# Altium schematic sheet RS_485_V.SchDoc
size C; SheetNumber: 2; SheetTotal: 3
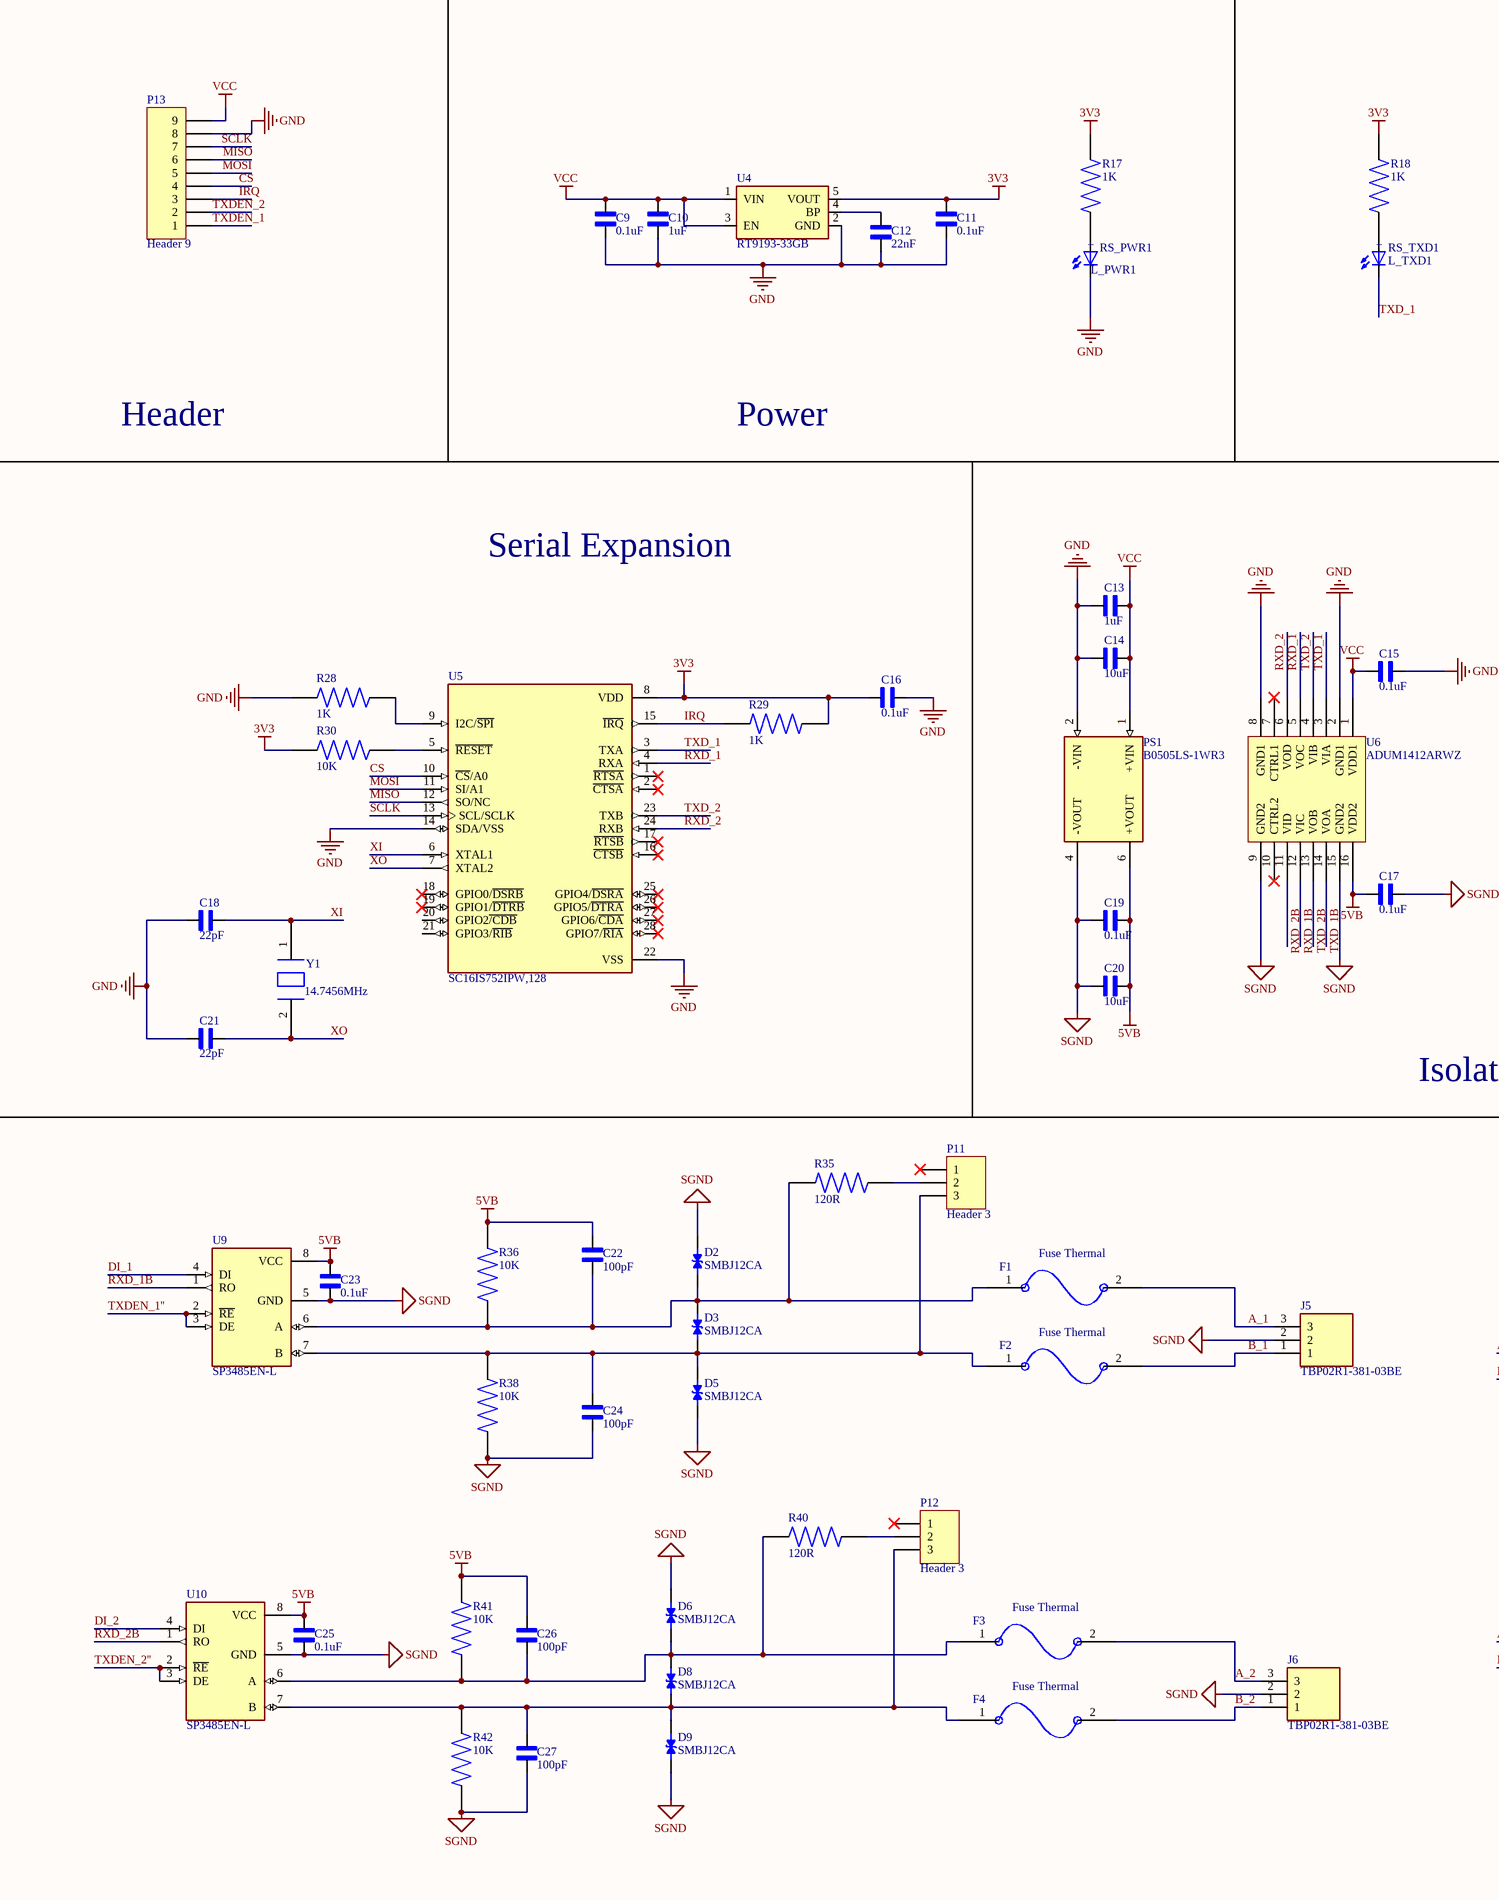
[diagram p0: RS_485_V.SchDoc, left]
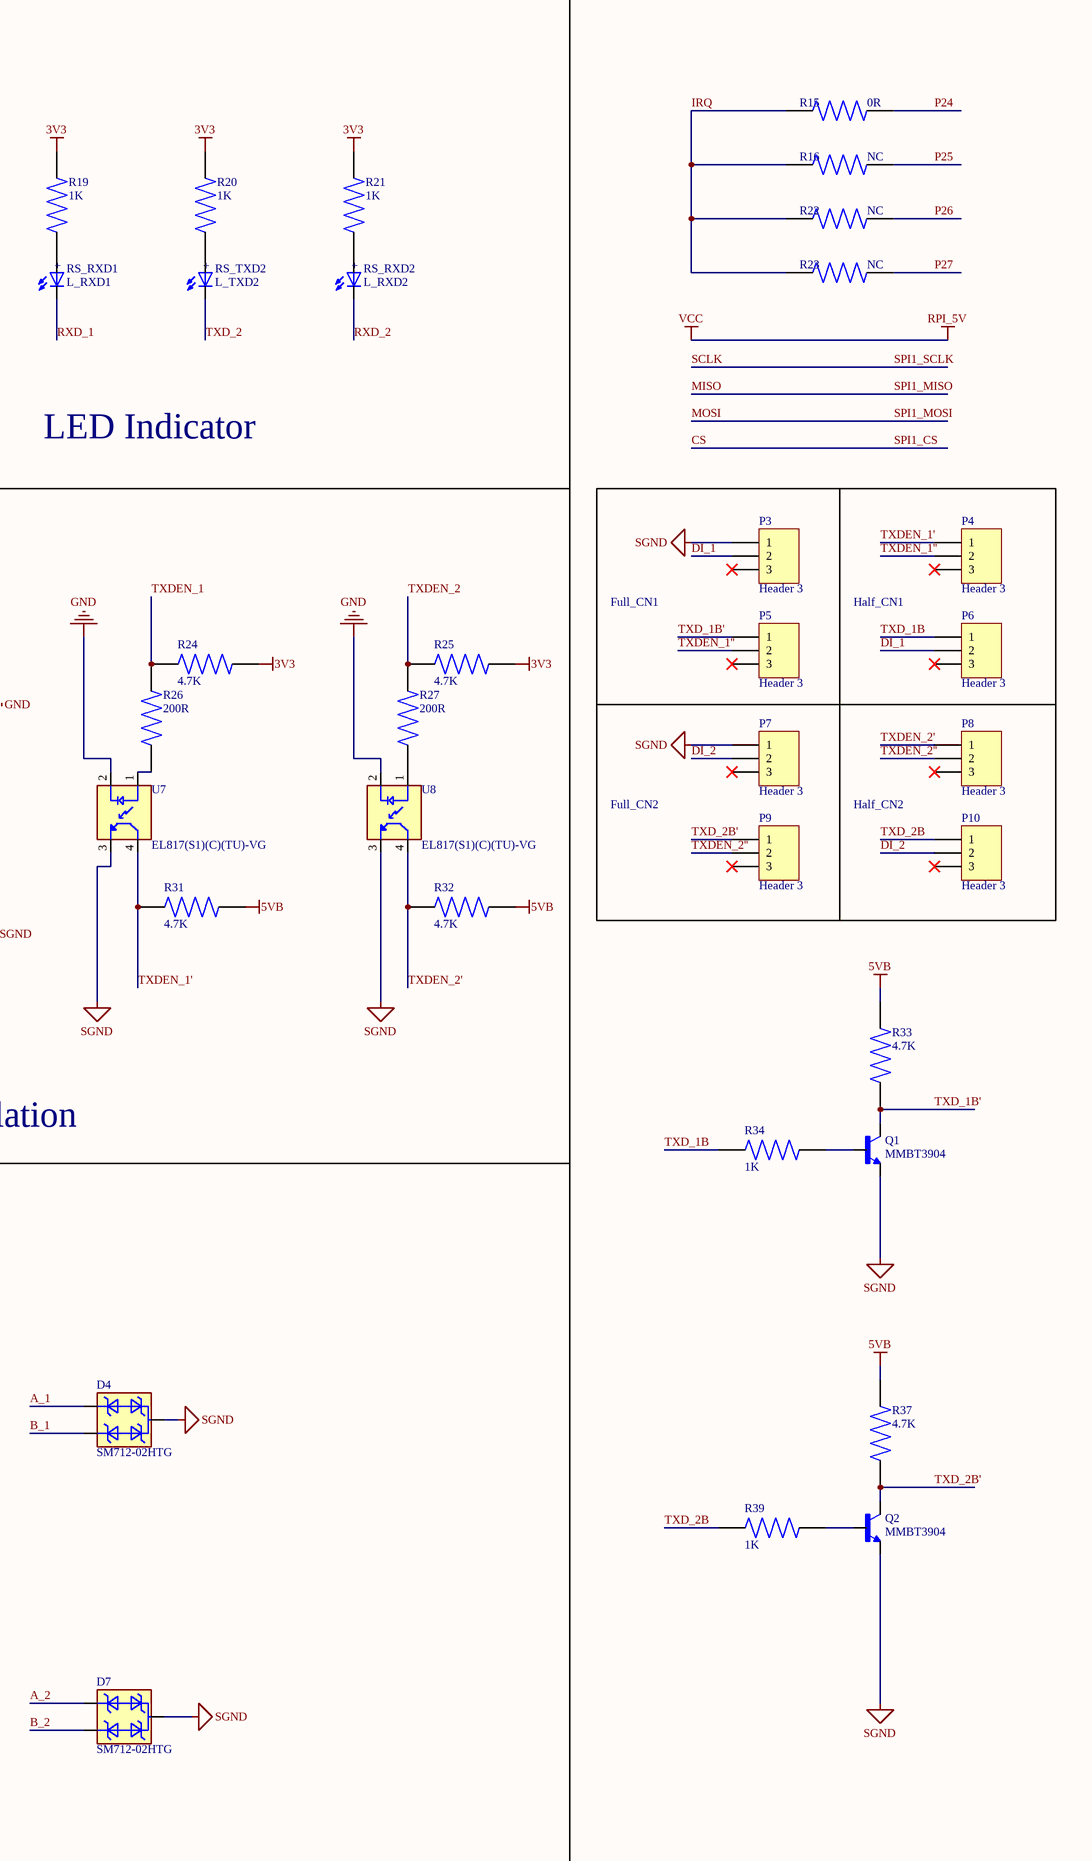
[diagram p1: RS_485_V.SchDoc, right]

## Parts
C9  0.1uF  [CAPC1608X94N]
C10  1uF  [CAPC1608X94N]
C11  0.1uF  [CAPC1608X94N]
C12  22nF  [CAPC1608X94N]
C13  1uF  [CAPC1608X94N]
C14  10uF  [CAPC1608X94N]
C15  0.1uF  [CAPC1608X94N]
C16  0.1uF  [CAPC1608X94N]
C17  0.1uF  [CAPC1608X94N]
C18  22pF  [CAPC1608X94N]
C19  0.1uF  [CAPC1608X94N]
C20  10uF  [CAPC1608X94N]
C21  22pF  [CAPC1608X94N]
C22  100pF  [CAPC1608X94N]
C23  0.1uF  [CAPC1608X94N]
C24  100pF  [CAPC1608X94N]
C25  0.1uF  [CAPC1608X94N]
C26  100pF  [CAPC1608X94N]
C27  100pF  [CAPC1608X94N]
D2  SMBJ12CA  [DIOM4336X265N]
D3  SMBJ12CA  [DIOM4336X265N]
D4  SM712-02HTG  [SOT23]
D5  SMBJ12CA  [DIOM4336X265N]
D6  SMBJ12CA  [DIOM4336X265N]
D7  SM712-02HTG  [SOT23]
D8  SMBJ12CA  [DIOM4336X265N]
D9  SMBJ12CA  [DIOM4336X265N]
F1  Fuse Thermal  [Fuse_thermal]
F2  Fuse Thermal  [Fuse_thermal]
F3  Fuse Thermal  [Fuse_thermal]
F4  Fuse Thermal  [Fuse_thermal]
J5  TBP02R1-381-03BE  [CUI_TBP02R1-381-03BE]
J6  TBP02R1-381-03BE  [CUI_TBP02R1-381-03BE]
P3  Header 3  [HDR1X3]
P4  Header 3  [HDR1X3]
P5  Header 3  [HDR1X3]
P6  Header 3  [HDR1X3]
P7  Header 3  [HDR1X3]
P8  Header 3  [HDR1X3]
P9  Header 3  [HDR1X3]
P10  Header 3  [HDR1X3]
P11  Header 3  [HDR1X3]
P12  Header 3  [HDR1X3]
P13  Header 9  [HDR1X9]
PS1  B0505LS-1WR3  [CONV_RFB-0505S]
Q1  MMBT3904  [TRANS_MMBT3904]
Q2  MMBT3904  [TRANS_MMBT3904]
R15  0R  [RES_ERJU03J474V]
R16  NC  [RES_ERJU03J474V]
R17  1K  [RES_ERJU03J474V]
R18  1K  [RES_ERJU03J474V]
R19  1K  [RES_ERJU03J474V]
R20  1K  [RES_ERJU03J474V]
R21  1K  [RES_ERJU03J474V]
R22  NC  [RES_ERJU03J474V]
R23  NC  [RES_ERJU03J474V]
R24  4.7K  [RES_ERJU03J474V]
R25  4.7K  [RES_ERJU03J474V]
R26  200R  [RES_ERJU03J474V]
R27  200R  [RES_ERJU03J474V]
R28  1K  [RES_ERJU03J474V]
R29  1K  [RES_ERJU03J474V]
R30  10K  [RES_ERJU03J474V]
R31  4.7K  [RES_ERJU03J474V]
R32  4.7K  [RES_ERJU03J474V]
R33  4.7K  [RES_ERJU03J474V]
R34  1K  [RES_ERJU03J474V]
R35  120R  [RES_ERJU03J474V]
R36  10K  [RES_ERJU03J474V]
R37  4.7K  [RES_ERJU03J474V]
R38  10K  [RES_ERJU03J474V]
R39  1K  [RES_ERJU03J474V]
R40  120R  [RES_ERJU03J474V]
R41  10K  [RES_ERJU03J474V]
R42  10K  [RES_ERJU03J474V]
RS_PWR1  L_PWR1  [WL-SMCW_1206]
RS_RXD1  L_RXD1  [WL-SMCW_1206]
RS_RXD2  L_RXD2  [WL-SMCW_1206]
RS_TXD1  L_TXD1  [WL-SMCW_1206]
RS_TXD2  L_TXD2  [WL-SMCW_1206]
U4  RT9193-33GB  [SOT23-5_TEXAS_INSTRUMETNS]
U5  SC16IS752IPW,128  [SOP65P640X110-28N]
U6  ADUM1412ARWZ  [SOIC127P1032X265-16N]
U7  EL817(S1)(C)(TU)-VG  [SOIC254P1030X390-4N_EL817(S1)(C)(TU)-VG]
U8  EL817(S1)(C)(TU)-VG  [SOIC254P1030X390-4N_EL817(S1)(C)(TU)-VG]
U9  SP3485EN-L  [SOIC127P599X175-8N]
U10  SP3485EN-L  [SOIC127P599X175-8N]
Y1  14.7456MHz  [CRY_HC_49_S]

## Nets
3V3: C11.2 C16.1 R17.2 R18.2 R19.2 R20.2 R21.2 R24.1 R25.1 R29.2 R30.1 U4.5(VOUT) U5.8(VDD)
5VB: C17.1 C19.2 C20.2 C22.1 C23.1 C25.1 C26.1 PS1.6(+VOUT) R31.1 R32.1 R33.2 R36.1 R37.2 R41.1 U6.16(VDD2) U9.8(VCC) U10.8(VCC)
GND: C9.1 C10.1 C11.1 C12.1 C13.1 C14.1 C15.2 C16.2 C18.1 C21.1 P13.8 PS1.2(-VIN) R28.1 RS_PWR1.1(NEG) U4.2(GND) U5.14(SDA/VSS) U5.22(VSS) U6.2(GND1) U6.8(GND1) U7.2(C) U8.2(C)
RPI_5V: C9.2 C10.2 C13.2 C14.2 C15.1 P13.9 PS1.1(+VIN) U4.1(VIN) U4.3(EN) U6.1(VDD1)  [also labelled VCC]
SGND: C17.2 C19.1 C20.1 C23.2 C24.2 C25.2 C27.2 D2.2 D4.3 D5.2 D6.2 D7.3 D9.2 J5.2 J6.2 P3.1 P7.1 PS1.4(-VOUT) Q1.2(E) Q2.2(E) R38.2 R42.2 U6.9(GND2) U6.15(GND2) U7.3(ET) U8.3(ET) U9.5(GND) U10.5(GND)
A_1: D4.1 F1.2 J5.3
A_2: D7.1 F3.2 J6.3
B_1: D4.2 F2.2 J5.1
B_2: D7.2 F4.2 J6.1
CS: P13.4 U5.10(~{CS}/A0)  [also labelled SPI1_CS]
DI_1: P3.2 P6.2 U9.4(DI)
DI_2: P7.2 P10.2 U10.4(DI)
IRQ: P13.3 R15.1 R16.1 R22.1 R23.1 R29.1 U5.15(~{IRQ})
MISO: P13.6 U5.12(SO/NC)  [also labelled SPI1_MISO]
MOSI: P13.5 U5.11(SI/A1)  [also labelled SPI1_MOSI]
P24: R15.2
P25: R16.2
P26: R22.2
P27: R23.2
RXD_1: RS_RXD1.1(NEG) U5.4(RXA) U6.5(VOC)
RXD_1B: U6.12(VIC) U9.1(RO)
RXD_2: RS_RXD2.1(NEG) U5.24(RXB) U6.6(VOD)
RXD_2B: U6.11(VID) U10.1(RO)
SCLK: P13.7 U5.13(SCL/SCLK)  [also labelled SPI1_SCLK]
TXD_1: RS_TXD1.1(NEG) U5.3(TXA) U6.3(VIA)
TXD_1B: P6.1 R34.1 U6.14(VOA)
TXD_1B': P5.1 Q1.3(C) R33.1
TXD_2: RS_TXD2.1(NEG) U5.23(TXB) U6.4(VIB)
TXD_2B: P10.1 R39.1 U6.13(VOB)
TXD_2B': P9.1 Q2.3(C) R37.1
TXDEN_1: P13.1 R24.2 R26.2
TXDEN_1': P4.1 R31.2 U7.4(CT)
TXDEN_1'': P4.2 P5.2 U9.2(~{RE}) U9.3(DE)
TXDEN_2: P13.2 R25.2 R27.2
TXDEN_2': P8.1 R32.2 U8.4(CT)
TXDEN_2'': P8.2 P9.2 U10.2(~{RE}) U10.3(DE)
XI: C18.2 U5.6(XTAL1) Y1.1
XO: C21.2 U5.7(XTAL2) Y1.2
NetC12_2: C12.2 U4.4(BP)
NetC22_2: C22.2 D2.1 D3.1 F1.1 R35.1 R36.2 U9.6(A)
NetC24_1: C24.1 D3.2 D5.1 F2.1 P11.3 R38.1 U9.7(B)
NetC26_2: C26.2 D6.1 D8.1 F3.1 R40.1 R41.2 U10.6(A)
NetC27_1: C27.1 D8.2 D9.1 F4.1 P12.3 R42.1 U10.7(B)
NetP11_2: P11.2 R35.2
NetP12_2: P12.2 R40.2
NetQ1_1: Q1.1(B) R34.2
NetQ2_1: Q2.1(B) R39.2
NetR17_1: R17.1 RS_PWR1.2(POS)
NetR18_1: R18.1 RS_TXD1.2(POS)
NetR19_1: R19.1 RS_RXD1.2(POS)
NetR20_1: R20.1 RS_TXD2.2(POS)
NetR21_1: R21.1 RS_RXD2.2(POS)
NetR26_1: R26.1 U7.1(A)
NetR27_1: R27.1 U8.1(A)
NetR28_2: R28.2 U5.9(I2C/~{SPI})
NetR30_2: R30.2 U5.5(~{RESET})

Not connected (* = marked no-connect by the designer): P3 3*; P4 3*; P5 3*; P6 3*; P7 3*; P8 3*; P9 3*; P10 3*; P11 1*; P12 1*; U5 1(~{RTSA})* 2(~{CTSA})* 16(~{CTSB})* 17(~{RTSB})* 18(GPIO0/~{DSRB})* 19(GPIO1/~{DTRB})* 20(GPIO2~{/CDB}) 21(GPIO3/~{RIB}) 25(GPIO4/~{DSRA})* 26(GPIO5/~{DTRA})* 27(GPIO6/~{CDA})* 28(GPIO7/~{RIA})*; U6 7(CTRL1)* 10(CTRL2)*

## Notes on the sheet
- LED Indicator
- Header
- Power
- Serial Expansion
- Full_CN1
- Half_CN1
- Full_CN2
- Half_CN2
- Isolation
- (in symbol WL-SMCW_1206) +

## Library data of the parts
C9-C27 = cap_0603_VJ0603D3R9DXCAP: cap 0603 (1608 Metric); MF: Vishay Vitramon; SnapEDA_Link: https://www.snapeda.com/parts/VJ0603D3R9DXCAP/Vishay/view-part/?ref=snap; Package: 1608 Vishay Vitramon; Value: *; MP: VJ0603D3R9DXCAP; Check_prices: https://www.snapeda.com/parts/VJ0603D3R9DXCAP/Vishay/view-part/?ref=eda
D2 D3 D5 D6 D8 D9 = SMBJ10CA-13-F: MF: {'manufacturer': u'Diodes Incorporated'}; Package: None; Price: None; Value: *; MP: SMBJ10CA-13-F; Availability: Unavailable
D4 D7 = SM712-02HTG: TVS Diode, SM712 Series, 31V Clamp, 600W Peak Pulse, Surface Mount, SOT23-3 | Littelfuse SM712-02HTG; MF: Littelfuse Inc.; SnapEDA_Link: https://www.snapeda.com/parts/SM712-02HTG/Littelfuse/view-part/?ref=snap; Package: SOT-23 Littelfuse Inc.; Value: *; MP: SM712-02HTG; Check_prices: https://www.snapeda.com/parts/SM712-02HTG/Littelfuse/view-part/?ref=eda
F1-F4 = Fuse Thermal: Fuse, Resettable, Fast Acting, 10A, Sz 1206, 0.134x0.071x0.033", SMT, 24VDC, PCB | Bourns MF-NSMF200-2
J5 J6 = TBP02R1-381-03BE: 2~24 Poles, Pluggable,Receptacle, Horizontal, 3.81 Pitch, Terminal Block Connector; MF: Same Sky; SnapEDA_Link: https://www.snapeda.com/parts/TBP02R1-381-03BE/Same+Sky/view-part/?ref=snap; Package: None; Value: *; MP: TBP02R1-381-03BE; Check_prices: https://www.snapeda.com/parts/TBP02R1-381-03BE/Same+Sky/view-part/?ref=eda
P3-P12 = Header 3: Header, 3-Pin; LatestRevisionDate: 17-Jul-2002; LatestRevisionNote: Re-released for DXP Platform.; Publisher: Altium Limited
P13 = Header 9: Header, 9-Pin; LatestRevisionDate: 17-Jul-2002; LatestRevisionNote: Re-released for DXP Platform.; Publisher: Altium Limited
PS1 = B0505LS-1WR3: 1W DC/DC-Converter 'ECONOLINE' SIP7 1kV unreg; MF: Recom Power; MP: RFB-0505S; SnapEDA_Link: https://www.snapeda.com/parts/RFB-0505S/Recom+Power/view-part/?ref=snap; Package: SIP-6 Recom Power; Value: *; Check_prices: https://www.snapeda.com/parts/RFB-0505S/Recom+Power/view-part/?ref=eda
Q1 Q2 = MMBT3904: BJT, SOT-23, 40V, 200mA, NPN, 0.35W, 150Â°C; MF: Diotec Semiconductor; SnapEDA_Link: https://www.snapeda.com/parts/MMBT3904/Diotec/view-part/?ref=snap; Package: SOT-23 Diotec; Value: *; MP: MMBT3904; Check_prices: https://www.snapeda.com/parts/MMBT3904/Diotec/view-part/?ref=eda
R15-R42 = res_0603_ERJU03J474V: 0603 Anti-Sulfurated; MF: Panasonic; SnapEDA_Link: https://www.snapeda.com/parts/ERJU03J474V/Panasonic/view-part/?ref=snap; Package: 1608-2 Panasonic; Value: *; MP: ERJU03J474V; Check_prices: https://www.snapeda.com/parts/ERJU03J474V/Panasonic/view-part/?ref=eda
RS_PWR1 RS_RXD1 RS_RXD2 RS_TXD1 RS_TXD2 = WL-SMCW_1206: 1206, Blue Typ.(@20mA): 470nm, 145mcd, 3.2V, 140Â° InGaN; MF: Wurth Electronics; MP: 150120BS75000; SnapEDA_Link: https://www.snapeda.com/parts/150120BS75000/Wurth+Electronics/view-part/?ref=snap; Package: 1206 Wurth Electronics; Value: *; Check_prices: https://www.snapeda.com/parts/150120BS75000/Wurth+Electronics/view-part/?ref=eda
U4 = RT9193-33GB: Linear Voltage Regulator IC Positive Fixed 1 Output  300mA SOT-23-5; MF: Richtek Technology Corp; MP: RT919333GB; SnapEDA_Link: https://www.snapeda.com/parts/RT919333GB/Richtek/view-part/?ref=snap; Package: SOT-23-5 Richtek; Value: *; Check_prices: https://www.snapeda.com/parts/RT919333GB/Richtek/view-part/?ref=eda
U5 = SC16IS752IPW,128: RS232, RS485 Controller - IÂ²C, SPI, UART Interface 28-TSSOP; MF: NXP Semiconductors; SnapEDA_Link: https://www.snapeda.com/parts/SC16IS752IPW,128/NXP+Semiconductors/view-part/?ref=snap; Package: TSSOP-28 NXP USA; Value: *; MP: SC16IS752IPW,128; Check_prices: https://www.snapeda.com/parts/SC16IS752IPW,128/NXP+Semiconductors/view-part/?ref=eda
U6 = ADUM1412ARWZ: Quad-Channel Digital Isolator
U7 U8 = EL817(S1)(C)(TU)-VG: Optoisolator Transistor Output 5000Vrms 1 Channel 4-SMD; MF: Everlight Electronics; MP: EL817(S1)(A)(TU)-VG; SnapEDA_Link: https://www.snapeda.com/parts/EL817(S1)(A)(TU)-VG/Everlight/view-part/?ref=snap; Package: NON STANDARD-4 Everlight; Value: *; Check_prices: https://www.snapeda.com/parts/EL817(S1)(A)(TU)-VG/Everlight/view-part/?ref=eda
U9 U10 = SP3485EN-L: 1/1 Transceiver Half RS422, RS485 8-SOIC; MF: MaxLinear, Inc.; SnapEDA_Link: https://www.snapeda.com/parts/SP3485EN-L/MaxLinear/view-part/?ref=snap; Package: None; Value: *; MP: SP3485EN-L; Check_prices: https://www.snapeda.com/parts/SP3485EN-L/MaxLinear/view-part/?ref=eda
Y1 = Thach anh: Crystal For all Crystal 2pin.